# EAGLE design ESP32_SensorShield (EAGLE 8.7.1)
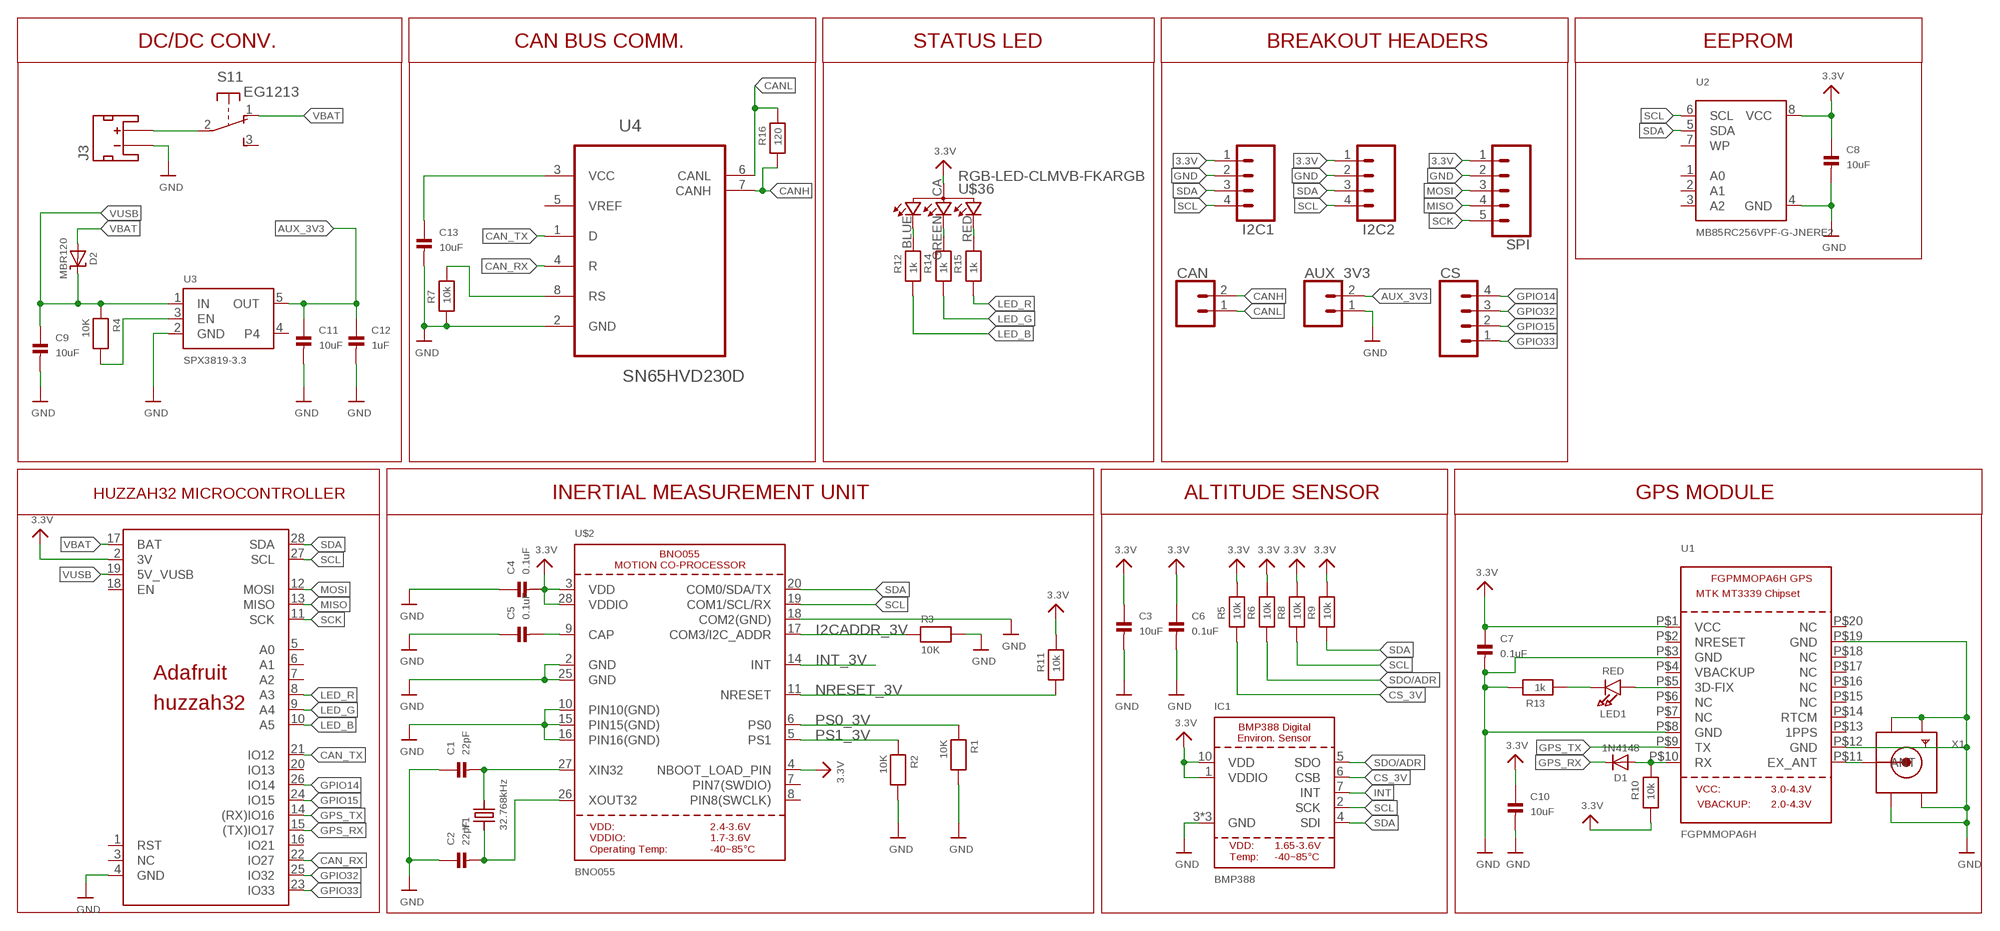
[diagram p0: schematic, sheet 1]

## Parts
AUX_3V3  CONN_02  [1X02]
C1  22pF  CAP_CERAMIC0603  [0603]
C2  22pF  CAP_CERAMIC0603  [0603]
C3  10uF  CAP_CERAMIC0805  [0805]
C4  0.1uF  CAP_CERAMIC0603  [0603]
C5  0.1uF  CAP_CERAMIC0603  [0603]
C6  0.1uF  CAP_CERAMIC0603  [0603]
C7  0.1uF  CAP_CERAMIC0603  [0603]
C8  10uF  CAP_CERAMIC0805  [0805]
C9  10uF  CAP_CERAMIC0805  [0805]
C10  10uF  CAP_CERAMIC0805  [0805]
C11  10uF  CAP_CERAMIC0805  [0805]
C12  1uF  CAP_CERAMIC0805  [0805]
C13  10uF  CAP_CERAMIC0805  [0805]
CAN  CONN_02  [1X02]
CS  CONN_04  [1X04]
D1  1N4148  DIODESOD-323  [SOD-323]
D2  MBR120  DIODE-SCHOTTKYSOD-123  [SOD-123]
I2C1  CONN_04  [1X04]
I2C2  CONN_04  [1X04]
IC1  BMP388  [BMP388]
J3  JST_2MM_MALE  [JST-2-SMD]
LED1  RED  LED0805  [CHIPLED_0805]
R1  10K  RESISTOR0603  [0603]
R2  10K  RESISTOR0603  [0603]
R3  10K  RESISTOR0603  [0603]
R4  10K  RESISTOR0603  [0603]
R5  10k  RESISTOR0603  [0603]
R6  10k  RESISTOR0603  [0603]
R7  10k  RESISTOR0603  [0603]
R8  10k  RESISTOR0603  [0603]
R9  10k  RESISTOR0603  [0603]
R10  10k  RESISTOR0603  [0603]
R11  10k  RESISTOR0603  [0603]
R12  1k  RESISTOR0603  [0603]
R13  1k  RESISTOR0603  [0603]
R14  1k  RESISTOR0603  [0603]
R15  1k  RESISTOR0603  [0603]
R16  120  RESISTOR0603  [0603]
S1  EG1213  [EG1213]
SPI  CONN_05  [1X05]
U1  FGPMMOPA6H  GPS_FGPMMOPA6H  [FGPMMOPA6H]
U2  MB85RC256VPF-G-JNERE2  FRAM_SOIC8_I2C  [SOIC8_208MIL]
U3  SPX3819-3.3  VREG_SOT23-5  [SOT23-5]
U4  SN65HVD230D  [SOIC127P600X175-8N]
U$1  ADAFRUIT-FEATHER-HUZZAH32-SHIELD  [ADAFRUIT-FEATHER-HUZZAH32-SHIELD]
U$2  BNO055  [BNO055]
U$36  RGB-LED-CLMVB-FKARGB  [PLCC4-2MM-RGB]
X1  SMACONNECTOR_EDGE  [SMA_EDGELAUNCH]
Y1  32.768kHz  CRYSTAL8.0X3.8  [CRYSTAL_8X3.8]

## Nets
3.3V: C3.1 C4.2 C6.1 C7.1 C8.1 C10.1 I2C1.1 I2C2.1 IC1.1(VDDIO) IC1.10(VDD) R5.2 R6.2 R8.2 R9.2 R10.1 R11.2 SPI.1 U1.P$1(VCC) U2.8(VCC) U$1.2(3V) U$2.3(VDD) U$2.4(NBOOT_LOAD_PIN) U$2.28(VDDIO) U$36.CA
AUX_3V3: AUX_3V3.2 C11.1 C12.1 U3.5(OUT)
CAN_RX: U4.4(R) U$1.22(IO27)
CAN_TX: U4.1(D) U$1.21(IO12)
CANH: CAN.2 R16.1 U4.7(CANH)
CANL: CAN.1 R16.2 U4.6(CANL)
CS_3V: IC1.6(CSB) R5.1
GND: AUX_3V3.1 C1.1 C2.1 C3.2 C4.1 C5.1 C6.2 C7.2 C8.2 C9.2 C10.2 C11.2 C12.2 C13.2 I2C1.2 I2C2.2 IC1.3(GND) IC1.8(GND) IC1.9(GND) J3.1(-) R1.2 R2.2 R3.2 R7.1 R13.2 SPI.2 U1.P$3(GND) U1.P$8(GND) U1.P$12(GND) U1.P$19(GND) U2.4(GND) U3.2(GND) U4.2(GND) U$1.4(GND) U$2.2(GND) U$2.10(PIN10(GND)) U$2.15(PIN15(GND)) U$2.16(PIN16(GND)) U$2.18(COM2(GND)) U$2.25(GND) X1.GND@1(GND4) X1.GND@2(GND3) X1.GND@3(GND2) X1.GND@4(GND1)
GPIO14: CS.4 U$1.26(IO14)
GPIO15: CS.2 U$1.24(IO15)
GPIO32: CS.3 U$1.25(IO32)
GPIO33: CS.1 U$1.23(IO33)
GPS_RX: D1.C U$1.15((TX)IO17)
GPS_TX: U1.P$9(TX) U$1.14((RX)IO16)
I2CADDR_3V: R3.1 U$2.17(COM3/I2C_ADDR)
INT: IC1.7(INT)
INT_3V: U$2.14(INT)
LED_B: R12.1 U$1.10(A5)
LED_G: R14.1 U$1.9(A4)
LED_R: R15.1 U$1.8(A3)
MISO: SPI.4 U$1.13(MISO)
MOSI: SPI.3 U$1.12(MOSI)
N$1: C1.2 U$2.27(XIN32) Y1.P$4
N$2: C2.2 U$2.26(XOUT32) Y1.P$1
N$3: U1.P$11(EX_ANT) X1.P(ANT)
N$4: C5.2 U$2.9(CAP)
N$5: D1.A R10.2 U1.P$10(RX)
N$6: J3.2(+) S1.2(1:P)
N$7: C13.1 U4.3(VCC)
N$8: LED1.C R13.1
N$9: LED1.A U1.P$5(3D-FIX)
N$10: R7.2 U4.8(RS)
N$11: R4.2 U3.3(EN)
N$12: R12.2 U$36.BLUE
N$13: R14.2 U$36.GREEN
N$14: R15.2 U$36.RED
NRESET_3V: R11.1 U$2.11(NRESET)
PS0_3V: R1.1 U$2.6(PS0)
PS1_3V: R2.1 U$2.5(PS1)
SCK: SPI.5 U$1.11(SCK)
SCL: I2C1.4 I2C2.4 IC1.2(SCK) R8.1 U2.6(SCL) U$1.27(SCL) U$2.19(COM1/SCL/RX)
SDA: I2C1.3 I2C2.3 IC1.4(SDI) R9.1 U2.5(SDA) U$1.28(SDA) U$2.20(COM0/SDA/TX)
SDO/ADR: IC1.5(SDO) R6.1
VBAT: D2.A S1.1(1:O) U$1.17(BAT)
VUSB: C9.1 D2.C R4.1 U3.1(IN) U$1.19(5V_VUSB)
Unconnected: J3.NC1(PAD1) J3.NC2(PAD2) S1.3(1:S) S1.MT1(MT) S1.MT2(MT) U1.P$2(NRESET) U1.P$4(VBACKUP) U1.P$6(NC) U1.P$7(NC) U1.P$13(1PPS) U1.P$14(RTCM) U1.P$15(NC) U1.P$16(NC) U1.P$17(NC) U1.P$18(NC) U1.P$20(NC) U2.1(A0) U2.2(A1) U2.3(A2) U2.7(WP) U3.4 U4.5(VREF) U$1.1(RST) U$1.3(NC) U$1.5(A0) U$1.6(A1) U$1.7(A2) U$1.16(IO21) U$1.18(EN) U$1.20(IO13) U$2.7(PIN7(SWDIO)) U$2.8(PIN8(SWCLK))

## Notes on the sheet
- DC/DC CONV. | CAN BUS COMM. | STATUS LED | BREAKOUT HEADERS | EEPROM
- HUZZAH32 MICROCONTROLLER | INERTIAL MEASUREMENT UNIT | ALTITUDE SENSOR | GPS MODULE

## Library data of the parts
AUX_3V3 CAN = SparkFun-Connectors:CONN_02: Multi connection point. Often used as Generic Header-pin footprint for 0.1 inch spaced/style header connections On any of the 0.1 inch spaced packages, you can populate with these: Break Away Headers - Straight <https://www.sparkfun.com/products/116> (PRT-00116) Break Away Male Headers - Right Angle <https://www.sparkfun.com/products/553> (PRT-00553) Female Headers <https://www.sparkfun.com/products/115> (PRT-00115) Break Away Headers - Machine Pin <https://www.sparkfun.com/products/117> (PRT-00117) Break Away Female Headers - Swiss Machine Pin <https://www.sparkfun.com/products/743> (PRT-00743) For SCREWTERMINALS and SPRING TERMINALS visit here: Screw Terimnals on SparkFun.com <https://www.sparkfun.com/search/results?term=Screw+Terminals> (5mm/3.5mm/2.54mm spacing) This device is also useful as a general connection point to wire up your design to another part of your project. Our various solder wires solder well into these plated through hole pads. Hook-Up Wire - Assortment (Stranded, 22 AWG) <https://www.sparkfun.com/products/11375> (PRT-11375) Hook-Up Wire - Assortment (Solid Core, 22 AWG) <https://www.sparkfun.com/products/11367> (PRT-11367) View the entire wire category on our website here <https://www.sparkfun.com/categories/141> Special notes: Molex polarized connector foot print use with: PRT-08233 with associated crimp pins and housings. 2.54_SCREWTERM for use with PRT-10571. 3.5mm Screw Terminal footprints for PRT-08084 5mm Screw Terminal footprints for use with PRT-08432
C1-C13 = microbuilder:CAP_CERAMIC: Ceramic Capacitors 0402 - 0402 Surface Mount Capacitors 16pF 50V 5% [Digikey: 445-4899-2-ND] 18pF 50V 5% [Digikey: 490-1281-2-ND] 22pF 50V 5% [Digikey: 490-1283-2-ND] 68pF 50V 5% [Digikey: 490-1289-2-ND] 0.1uF 10V 10% [Digikey: 490-1318-2-ND] 1.0uF 6.3V 10% [Digikey: 490-1320-2-ND] 0603 - 0603 Surface Mount Capacitors 16 pF 50V 5% [Digikey: 445-5051-2-ND] 22 pF 50V [Digikey: PCC220ACVTR-ND] 33 pF 50V 5% [Digikey: 490-1415-1-ND] 56pF 50V 5% [Digikey: 490-1421-1-ND] 220pF 50V 5% [Digikey: 445-1285-1-ND] 680 pF 50V 2200 pF 50V 5% C0G [Digikey: 445-1297-1-ND] 5600 pF 100V 5% X7R [Digikey: 478-3711-1-ND] 0.1 µF 25V 10% [Digikey: PCC2277TR-ND] 0.22 µF 16V 10% X7R [Digikey: 445-1318-1-ND] 1.0 µF 25V 10% [Digikey: 445-5146-2-ND] 0603 - RF Specific 3pF 250V +/-0.1pF RF [Digikey: 712-1347-1-ND] 18 pF 250V 5% [Digikey: 478-3505-1-ND or 712-1322-1-ND] 56 pF 250V 5% C0G RF [Digikey: 490-4867-1-ND] 68 pF 250V RF [Digikey: 490-4868-1-ND] 0805 - 0805 Surface Mount Capacitors 220 pF 250V 2% RF Ceramic Capacitor [Digikey: 712-1398-1-ND] 1000 pF 50V 2% NP0 Ceramic Capacitor [Digikey: 478-3760-1-ND] 0.1 µF 25V 10% Ceramic Capacitor [Digikey: PCC1828TR-ND] 1.0 µF 16V 10% Ceramic Capacitor[Digikey: 490-1691-2-ND] 10.0 µF 10V 10% Ceramic Capacitor[Digikey: 709-1228-1-ND] 10.0 uF 16V 10% Ceramic Capacitor [Digikey: 478-5165-2-ND] 47 uF 6.3V 20% Ceramic Capacitor [Digikey: 587-1779-1-ND or 399-5506-1-ND] 1206 - 1206 Surface Mount Capacitors 47uF 10V 20% Ceramic Capacitor [Digikey: 490-5528-1-ND or 399-5508-1-ND or 445-6010-1-ND]
CS I2C1 I2C2 = SparkFun-Connectors:CONN_04: Multi connection point. Often used as Generic Header-pin footprint for 0.1 inch spaced/style header connections On any of the 0.1 inch spaced packages, you can populate with these: Break Away Headers - Straight <https://www.sparkfun.com/products/116> (PRT-00116) Break Away Male Headers - Right Angle <https://www.sparkfun.com/products/553> (PRT-00553) Female Headers <https://www.sparkfun.com/products/115> (PRT-00115) Break Away Headers - Machine Pin <https://www.sparkfun.com/products/117> (PRT-00117) Break Away Female Headers - Swiss Machine Pin <https://www.sparkfun.com/products/743> (PRT-00743) For SCREWTERMINALS and SPRING TERMINALS visit here: Screw Terimnals on SparkFun.com <https://www.sparkfun.com/search/results?term=Screw+Terminals> (5mm/3.5mm/2.54mm spacing) This device is also useful as a general connection point to wire up your design to another part of your project. Our various solder wires solder well into these plated through hole pads. Hook-Up Wire - Assortment (Stranded, 22 AWG) <https://www.sparkfun.com/products/11375> (PRT-11375) Hook-Up Wire - Assortment (Solid Core, 22 AWG) <https://www.sparkfun.com/products/11367> (PRT-11367) View the entire wire category on our website here <https://www.sparkfun.com/categories/141> Special notes: Molex polarized connector foot print use with SKU : PRT-08231 with associated crimp pins and housings. 1MM SMD Version SKU: PRT-10208; PROD_ID: CONN-09696
D1 = microbuilder:DIODE: Diode SMA Model Volts Amps Type Vf Ir Digikey # Notes SSA34-E3 40V 3A Schottky 480mV @ 3A 200uA @ 40V SSA34-E3/61TGITR-ND CDBA120-G 20V 1A Schottky 500mV @ 1A 500uA @ 20V 641-1014-6-ND REEL MBRA210 10V 2A Schottky 350mV @ 2A 700uA @ 10V MBRA210LT3 SOD-123 Model Volts Amps Type Vf Ir Order # Notes BAT54T1G 30V 200mA Schottky 800mV @ 200mA 2uA @ 25V BAT54T1GOSTR-ND B0530W 30V 500mA Schottky 430mV @ 500mA 130uA @ 30V B0530W-FDICT-ND REEL MBR120 20V 1A Schottky 340mV @ 1A MBR120VLSFT1GOSCT-ND SOD-323 Model Volts Amps Type Vf Ir Order # Notes PMEG2005EJ 20V 500mA Schottky 355mV @ 500mA 568-4110-1-ND ZLLS410 10V 570mA Schottky 380mV @ 570mA ZLLS410CT-ND 1N4148WS 75V 150mA Silicon/Simple 1V 1N4148WSFSCT-ND REEL SOD-523 Model Volts Amps Type Vf Ir Order # Notes BAT54XV2 30V 200mA Schottky 0.8V @ 100mA BAT54XV2CT-ND TB751S 30V 30mA Schottky RB751S-40TE61CT-ND SOT23-R/W (R = Solder Paste/Reflow Ovens, W = Hand-Soldering) Model Volts Amps Type Vf Ir Order # Notes BAT54FILM 40V 300mA Schottky 497-7162-1-ND POWERDI-5 Model Volts Amps Type Vf Ir Order # Notes PDS560 60V 5A Schottky 670mV @ 5A 150uA @ 60V PDS560DICT-ND
D2 = microbuilder:DIODE-SCHOTTKY
IC1 = microbuilder:BMP388
J3 = SparkFun-Connectors:JST_2MM_MALE: JST 2MM MALE RA CONNECTOR Two pin, compact surface mount connector. Commonly used as a battery input connection point. We really like the solid locking feeling and high current rating on these small connectors. We use these all the time as battery connectors. Mates to single-cell LiPo batteries. Here is the connector we sell at SparkFun: JST Right Angle Connector - White <https://www.sparkfun.com/products/8612> (PRT-08612) Datasheet <http://www.sparkfun.com/datasheets/Prototyping/Connectors/JST-Horizontal.pdf> It was used on these SparkFun products: SparkFun MOSFET Power Controller <https://www.sparkfun.com/products/11214> (PRT-11214) SparkFun Battery Babysitter - LiPo Battery Manager <https://www.sparkfun.com/products/13777> (PRT-13777) And many, many others that required a lipo battery connection.; PROD_ID: CONN-11443; SF_ID: PRT-08612
LED1 = microbuilder:LED: LED 0603 - 0603 Surface Mount Package 2mA: Green LED - Low Power (3.9mcd, 2ma, 1.7Vf) - Digikey: 475-2709-2-ND Orange LED - Low Power (9.8mcd, 2ma, 1.8Vf) - Digikey: 475-1194-2-ND Red LED - Low Power (5mcd, 2ma, 1.8Vf) - Digikey: 475-1195-2-ND Yellow LED - Low Power (7mcd, 2ma, 1.8Vf) - Digikey: 475-1196-2-ND 5mA: Blue LED - Low Power (17mcd, 5ma, 2.9Vf) - Digikey: LNJ937W8CRACT-ND 0805 - 0805 Surface Mount Package 2mA: Red LED (8.8mcd, 2mA, 1.8Vf, Clear) - Low Power [Digikey: 475-2510-1-ND] Green LED (5mcd, 2mA, 1.8Vf, Clear) - Low Power [Digikey: 475-2730-1-ND] Yellow LED (11.3mcd, 2mA, 1.8Vf, Clear) - Low Power [Digikey: 475-2555-1-ND] 20mA: Red LED (104mcd, 20mA, Diffused) - LS R976 [Digikey: 475-1278-6-ND] Red LED (12mcd, 20mA, 2.0Vf, Clear) - APT2012EC [Digikey: 754-1128-1-ND] Green LED (15mcd, 20mA, 2.2Vf, Clear) - APT2012GC [Digikey: 754-1131-1-ND] Orange LED (160mcd, 20mA, 2.1Vf, Clear) - APT2012SECK [Digikey: 754-1130-1-ND] 1206 - 1206 Surface Mount Package Green LED (26mcd, 20mA, Diffused) - LG N971 [Digikey: 475-1407-6-ND] Red LED (15mcd, 20mA, Diffused) - LH N974 [Digikey: 475-1416-6-ND] Cree - Cree High-Power Surface Mount LEDs XPEBWT-L1-0000-00D50 - White 111lm 350mA 2.9Vf 6200K 110° XTEAWT-00-0000-00000LEE3 - White 114lm 350mA 2.85Vf 5000K 115° Everlight - Everlight 45-21 Series Surface Mount LEDs 45-21/QK2C-B2832AC2CB2/2T - Warm White 2000mcd 20mA 3.25Vf 3050K 120° 45-21/LK2C-B38452C4CB2/2T - Nuetral White 2000mcd 20mA 3.25Vf 4150K 120° 45-21/LK2C-B50634C6CB2/2T - Cold White 2200mcd 20mA 3.25Vf 5650K 120° PLCC2 Reverse Mount LS T77K-J1L2-1-0-2-R18-Z - Red 11.25mcd 2mA 1.8Vf 630nm 120° LO T77K-L1M2-24-Z - Orange 19.6mcd 2mA 1.8Vf 606nm 120° LY T77K-K2M1-26-Z - Yellow 15.7mcd 2mA 1.8Vf 587nm 120°
R1-R16 = microbuilder:RESISTOR: Resistors 0402 - 0402 Surface Mount Package 22 Ohm 1% 1/16W [Digikey: 311-22.0LRTR-ND] 33 Ohm 5% 1/16W 1.0K 5% 1/16W 1.5K 5% 1/16W 2.0K 1% 1/16W 10.0K 1% 1/16W [Digikey: 311-10.0KLRTR-ND] 10.0K 5% 1/16W [Digikey: RMCF0402JT10K0TR-ND] 12.1K 1% 1/16W [Digikey: 311-22.0LRTR-ND] 100.0K 5% 1/16W 0603 - 0603 Surface Mount Package 0 Ohm 1/10 Watt 1% Resistor 15 Ohm 1/10 Watt 1% Resistor 33 Ohm 1/10 Watt 1% Resistor 49.9 Ohm 1/10 Watt 1% Resistor 100 Ohm 1/10 Watt 1% Resistor 150 Ohm 1/10 Watt 1% Resistor 240 Ohm 1/10 Watt 1% Resistor 390 Ohm 1/10 Watt 1% Resistor 560 Ohm 1/10 Watt 1% Resistor 680 Ohm 1/10 Watt 1% Resistor 750 Ohm 1/10 Watt 1% Resistor 1.0K Ohm 1/10 Watt 1% Resistor 1.5K Ohm 1/10 Watt 1% Resistor 2.0K Ohm 1/10 Watt 1% Resistor 2.2K Ohm 1/10 Watt 1% Resistor 3.3K Ohm 1/10 Watt 1% Resistor 4.7K Ohm 1/10 Watt 1% Resistor 10.0K Ohm 1/10 Watt 1% Resistor 12.0K Ohm 1/10 Watt 1% Resistor 12.1K Ohm 1/10 Watt 1% Resistor 20.0K Ohm 1/10 Watt 1% Resistor 33.0K Ohm 1/10 Watt 1% Resistor 100.0K Ohm 1/10 Watt 1% Resistor 0805 - 0805 Surface Mount Package 0 Ohm 1/8 Watt 1% Resistor 33 Ohm 1/8 Watt 1% Resistor 100 Ohm 1/8 Watt 1% Resistor 150 Ohm 1/8 Watt 1% Resistor 200 Ohm 1/8 Watt 1% Resistor 240 Ohm 1/8 Watt 1% Resistor 330 Ohm 1/8 Watt 1% Resistor 390 Ohm 1/8 Watt 1% Resistor 470 Ohm 1/8 Watt 1% Resistor 1.0K Ohm 1/8 Watt 1% Resistor 1.5K Ohm 1/8 Watt 1% Resistor 2.0K Ohm 1/8 Watt 1% Resistor 4.7K Ohm 1/8 Watt 1% Resistor 5.1K Ohm 1/8 Watt 1% Resistor 5.6K Ohm 1/8 Watt 1% Resistor 10.0K Ohm 1/8 Watt 1% Resistor 22.0K Ohm 1/8 Watt 1% Resistor 33.0K Ohm 1/8 Watt 1% Resistor 100K Ohm 1/8 Watt 1% Resistor 1206 - 1206 Surface Mount Package 2012 - 2010 Surface Mount Package 0.11 Ohm 1/2 Watt 1% Resistor - Digikey: RHM.11UCT-ND
S1 = adafruit:EG1213: E-Switch right-angle slide SPDT Part #EG1213 http://www.ladyada.net/library/eagle
SPI = SparkFun-Connectors:CONN_05: Multi connection point. Often used as Generic Header-pin footprint for 0.1 inch spaced/style header connections On any of the 0.1 inch spaced packages, you can populate with these: Break Away Headers - Straight <https://www.sparkfun.com/products/116> (PRT-00116) Break Away Male Headers - Right Angle <https://www.sparkfun.com/products/553> (PRT-00553) Female Headers <https://www.sparkfun.com/products/115> (PRT-00115) Break Away Headers - Machine Pin <https://www.sparkfun.com/products/117> (PRT-00117) Break Away Female Headers - Swiss Machine Pin <https://www.sparkfun.com/products/743> (PRT-00743) For SCREWTERMINALS and SPRING TERMINALS visit here: Screw Terimnals on SparkFun.com <https://www.sparkfun.com/search/results?term=Screw+Terminals> (5mm/3.5mm/2.54mm spacing) This device is also useful as a general connection point to wire up your design to another part of your project. Our various solder wires solder well into these plated through hole pads. Hook-Up Wire - Assortment (Stranded, 22 AWG) <https://www.sparkfun.com/products/11375> (PRT-11375) Hook-Up Wire - Assortment (Solid Core, 22 AWG) <https://www.sparkfun.com/products/11367> (PRT-11367) View the entire wire category on our website here <https://www.sparkfun.com/categories/141> Special notes: Molex polarized connector foot print use with SKU : PRT-08231 with associated crimp pins and housings. 1MM SMD Version SKU: PRT-10208
U1 = microbuilder:GPS_FGPMMOPA6H: GPS Module - MTK MT3339 Chipset, -165dBm sensitivity, 22 channels, 10Hz, auto-select external antenna options
U2 = microbuilder:FRAM_SOIC8_I2C: I2C FRAM - SOIC8 Package 256KBit (32Kx8) - MB85RC256VPF-G-JNERE2 - SOIC-8 200 Mil, 2.7-5.5V, -40°C-85°C
U3 = microbuilder:VREG_SOT23-5: SOT23-5 Fixed Voltage Regulators Part Current Out V Out V In V Dropout θJA (°C/W) TJ (°C) Digikey Part No. ADP121 150mA 3.3V 3.4-5.5V 0.09V @ 150mA -- -- ADP121-AUJZ33R7CT-ND ADP121 150mA 3.0V 3.1-5.5V 0.09V @ 150mA -- -- ADP121-AUJZ30R7CT-ND ADP122 300mA 3.3V 3.4-5.5V 0.085V @ 300mA -- -- ADP122AUJZ-3.3-R7CT-ND ADP1712 300mA 3.3V 3.5-5.5V 0.17V @ 300mA -- -- ADP1712AUJZ-3.3-R7TR-ND AP7311 (Low Cost) 150mA 3.3V 3.5-6V 0.15V @ 150mA -- -- AP7311-33WG-7DICT-ND LD39015M18R 150mA 1.8V 1.9V-5.5V 0.08V @ 100mA -- -- 497-6977-1-ND LP2985A-33DBVR 150mA 3.3V 3.3-16V 0.28V @ 150mA 206 150 296-18479-1-ND MCP1824T-3302E/OT 300mA 3.3V 3.5V-6V 0.2V @ 300mA -- -- MCP1824T-3302E/OTCT-ND MIC5205-2.5YM5 TR 150mA 2.5V 2.7-16V 0.165V @ 150mA -- -- 576-1257-2-ND MIC5205-3.0YM5 TR 150mA 3.0V 3.2V-16V 0.165V @ 150mA -- -- 576-1258-2-ND MIC5205-3.3YM5 TR 150mA 3.3V 3.5V-16V 0.165V @ 150mA -- -- 576-1259-2-ND TPS780330220 150mA 3.3V+2.2V 3.6-5.5V 250mV Max -- -- 296-23332-1-ND TDA3663/N1,135 100mA 3.3V 3.5-45V 0.18V @ 50mA -- -- 568-5343-1-ND Max operating temp can be calculated using θJA, TJ (max junction temperature), and power in watts. Set the "Maximum Ambient Temperature" until it reaches TJ ("Max Junction Temperature"), which is the absolute limit for safe use of the regulator: Heat Sink Temperature Calculator <http://www.daycounter.com/Calculators/Heat-Sink-Temperature-Calculator.phtml> For example, With 12V source into a 3.3V LP2985 and a 30mA load, we are dissipating (12V-3.3V) * 0.03A = 0.261W. With a θJA of 206 °C/W, a TJ of 150°C, and 261mW we can safely use the chip without a heat sink up to 75°C (=147.1°C Junction Temperature).
U4 = SN65HVD230D:SN65HVD230D: 3.3-V CAN TRANSCEIVERS; AVAILABILITY: Unavailable; DESCRIPTION: 1/1 Transceiver Half CANbus 8-SOIC; MF: Texas Instruments; MP: SN65HVD230D; PACKAGE: SOIC-8 Texas Instruments; PRICE: None
U$1 = Shawn'sCustomComponents:ADAFRUIT-FEATHER-HUZZAH32-SHIELD
U$2 = microbuilder:BNO055: BNO055 - Motion Co-Processor
U$36 = Particle:RGB-LED-CLMVB-FKA: CREE CLMVB-FKA RGB LED 2mm x 2mm
X1 = adafruit:SMACONNECTOR: SMA Connector 90° DIP SMA Connector, 50 Ohm (4UConnector: 07259)
Y1 = microbuilder:CRYSTAL: Crystals HC49UP - Surface Mount Crystal 4.0MHz 18pF +/-30ppm Surface Mount Crystal [Digikey: 535-9857-1-ND] 12.0 MHz Surface Mount Crystal [Digikey: 535-9869-6-ND] 25.0 MHz Surface Mount Crystal [Digikey: 535-9078-1-ND] 2.5 x 2.0mm - MEMs SMT Crystal 16.0 MHz 10pF 20ppm 2.5 x 2.0mm Crystal [Digikey -40-85°C: 535-10923-1-ND] 3.2 x 2.5mm - MEMs SMT Crystal 12.0 MHz 8pF 15ppm 3.2 x 2.5mm Crystal [Digikey: -10-70°C: 644-1047-1-ND -40-125°C: 644-1128-1-ND] 40~85°C cheaper: 644-1173-6-ND 16.0 MHz 8pF 15ppm 3.2 x 2.5mm Crystal [Digikey: -10-70°C: 644-1049-1-ND -40-125°C: 644-1129-2-ND]-40~85°C cheaper: 644-1175-6-ND 16.0 MHz 10pF 10ppm 3.2 x 2.5mm Crystal [Digikey: 644-1100-1-ND] 27.12 MHz 18pF 30ppm 3.2 x 2.5mm Crystal [Digikey: 887-1424-1-ND] 27.12MHz 10pF 10ppm 3.2 x 2.5mm Crystal [Digikey: 887-1329-1-ND] 4.9 x 1.8mm - MEMs SMT Crystal 32.768 KHz 12.5pF 20ppm 4.9 x 1.8mm Crystal [Digikey: SE2415CT-ND] 8.0 x 3.8mm - Surface Mount Crystal 32.768kHz 12.5pF 20ppm -40°C-85°C [Digikey: 535-9166-2-ND] Cylinder 32.768KHz Cylinder Crystal (2x6mm body) [Ex. Digikey: 300-8341-2-ND]

## Board
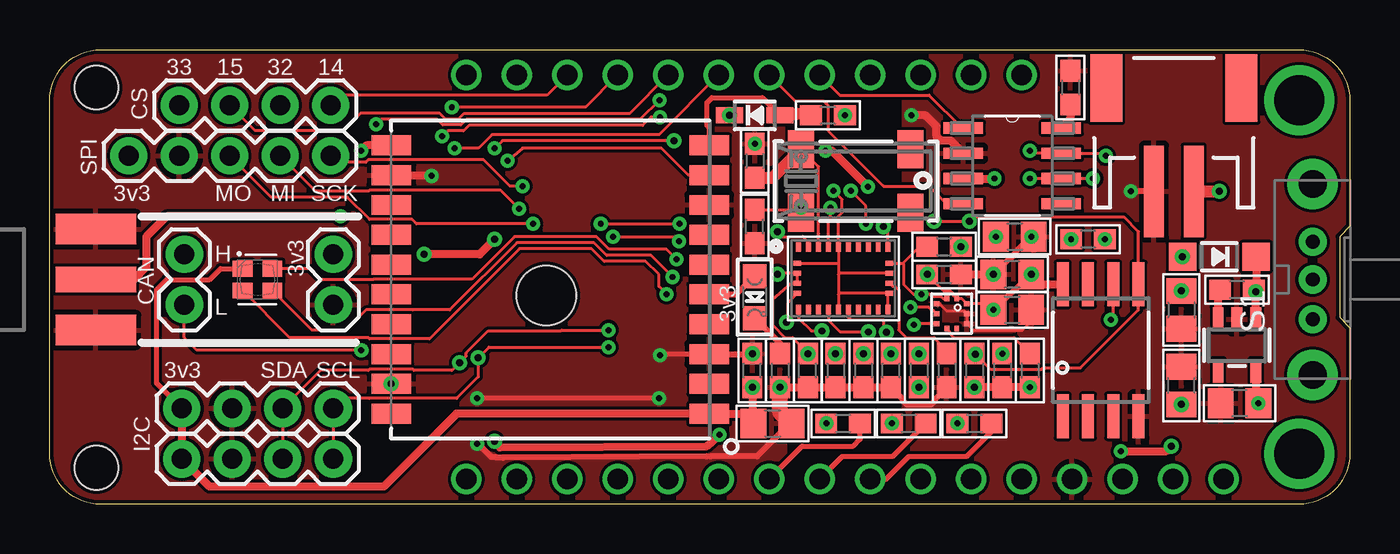
[diagram p1: board, top side]
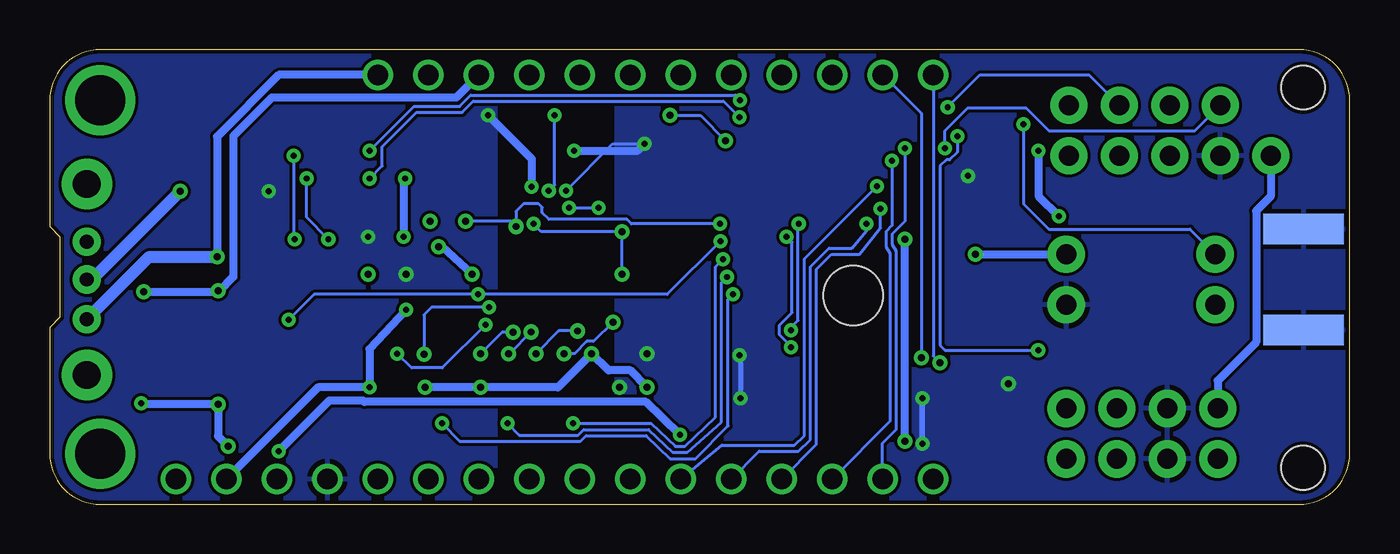
[diagram p2: board, bottom side, seen from below]

Size 65.41 x 22.86 mm. Coordinates in mm from the lower left corner, seen from the top.
Copper layers (1*16): Top 0.035mm / dielectric 1.5mm / Bottom 0.035mm
Design rules "default *": minimum track width 6mil, minimum drill 0.35mm, track to track 6mil, track to pad 6mil, pad to pad 6mil, via to via 6mil, smd to smd 6mil, copper to edge 8mil, drill to drill 6mil, minimum pad ring 10mil, minimum via ring 8mil, stop-mask expansion 4mil, vias tented up to drill 0mil, thermal gap 10mil

### Footprints (pad centres in the part's own frame; a part is rotated, then mirrored left to right if it is on the bottom)
1X02 = drill 1.016 pad 1.88: 1 0,0; 2 2.54,0
0603 = smd 1.1 x 1: 1 -0.85,0; 2 0.85,0
0805 = smd 1.3 x 1.5: 1 -0.95,0; 2 0.95,0
1X04 = drill 1.016 pad 1.88: 1 0,0; 2 2.54,0; 3 5.08,0; 4 7.62,0
SOD-323 = smd 1.35 x 0.8: A 1.27,0; C -1.27,0
SOD-123 = smd 1.4 x 1.4: A 1.85,0; C -1.85,0
BMP388 = smd 0.25 x 0.275: 1 0.25,0.75; 2 -0.25,0.75; 6 -0.25,-0.75; 7 0.25,-0.75 | smd 0.275 x 0.25: 3 -0.762,0.5; 4 -0.762,0; 5 -0.762,-0.5; 8 0.762,-0.5; 9 0.762,0; 10 0.762,0.5
JST-2-SMD = smd 1 x 4.6: 1 -1,-3.7; 2 1,-3.7 | smd 1.6 x 3.4: NC1 -3.4,1.5; NC2 3.4,1.5
CHIPLED_0805 = smd 1.2 x 1.2: A 0,-1.05; C 0,1.05
EG1213 = drill 0.7 pad 1.422: 1 -2,0; 2 0,0; 3 1.9,0 | drill 1.4 pad 2.54: MT1 -4.8,0; MT2 4.8,0
1X05 = drill 1.016 pad 1.88: 1 0,0; 2 2.54,0; 3 5.08,0; 4 7.62,0; 5 10.16,0
FGPMMOPA6H = smd 2 x 1: P$1 -8,6.75; P$2 -8,5.25; P$3 -8,3.75; P$4 -8,2.25; P$5 -8,0.75; P$6 -8,-0.75; P$7 -8,-2.25; P$8 -8,-3.75; P$9 -8,-5.25; P$10 -8,-6.75; P$11 8,-6.75; P$12 8,-5.25; P$13 8,-3.75; P$14 8,-2.25; P$15 8,-0.75; P$16 8,0.75; P$17 8,2.25; P$18 8,3.75; P$19 8,5.25; P$20 8,6.75 | hole 3: 0.2,0.8
SOIC8_208MIL = smd 0.6 x 2.2: 1 -1.905,-3.315; 2 -0.635,-3.315; 3 0.635,-3.315; 4 1.905,-3.315; 5 1.905,3.315; 6 0.635,3.315; 7 -0.635,3.315; 8 -1.905,3.315
SOT23-5 = smd 0.55 x 1.2: 1 -0.95,-1.3; 2 0,-1.3; 3 0.95,-1.3; 4 0.95,1.3; 5 -0.95,1.3
SOIC127P600X175-8N = smd 1.981 x 0.559: 1 -2.464,1.905; 2 -2.464,0.635; 3 -2.464,-0.635; 4 -2.464,-1.905; 5 2.464,-1.905; 6 2.464,-0.635; 7 2.464,0.635; 8 2.464,1.905
ADAFRUIT-FEATHER-HUZZAH32-SHIELD = drill 1.016: 1 6.16,1.397; 2 8.7,1.397; 3 11.239,1.397; 4 13.78,1.397; 5 16.32,1.397; 6 18.86,1.397; 7 21.399,1.397; 8 23.939,1.397; 9 26.48,1.397; 10 29.02,1.397; 11 31.559,1.397; 12 34.099,1.397; 13 36.639,1.397; 14 39.179,1.397; 15 41.719,1.397; 16 44.26,1.397; 17 16.32,21.717; 18 18.86,21.717; 19 21.399,21.717; 20 23.939,21.717; 21 26.48,21.717; 22 29.02,21.717; 23 31.559,21.717; 24 34.099,21.717; 25 36.639,21.717; 26 39.179,21.717; 27 41.719,21.717; 28 44.26,21.717 | drill 2.5: 29 2.349,20.447; 30 2.349,2.667 | hole 2.2: 62.865,1.968; 62.865,21.082
BNO055 = smd 0.25 x 0.475: 1 -2.25,1.562; 6 -2.25,-1.562; 7 -1.75,-1.562; 8 -1.25,-1.562; 9 -0.75,-1.562; 10 -0.25,-1.562; 11 0.25,-1.562; 12 0.75,-1.562; 13 1.25,-1.562; 14 1.75,-1.562; 15 2.25,-1.562; 20 2.25,1.562; 21 1.75,1.562; 22 1.25,1.562; 23 0.75,1.562; 24 0.25,1.562; 25 -0.25,1.562; 26 -0.75,1.562; 27 -1.25,1.562; 28 -1.75,1.562 | smd 0.375 x 0.25: 2 -2.312,0.75; 3 -2.312,0.25; 4 -2.312,-0.25; 5 -2.312,-0.75; 16 2.312,-0.75; 17 2.312,-0.25; 18 2.312,0.25; 19 2.312,0.75
PLCC4-2MM-RGB = smd 1 x 0.8: BLUE -0.75,-0.55; CA 0.75,-0.55; GREEN -0.75,0.55; RED 0.75,0.55
SMA_EDGELAUNCH = smd 4.064 x 1.524: GND@1 2.032,-2.54; GND@2 2.032,2.54 | smd 4.064 x 1.524 bottom: GND@3 2.032,2.54; GND@4 2.032,-2.54 | smd 4.064 x 1.27: P 2.032,0
CRYSTAL_8X3.8 = smd 1.3 x 1.9: P$1 -2.75,-1.6; P$2 2.75,-1.6; P$3 2.75,1.6; P$4 -2.75,1.6

### Placement (x,y rotation side)
AUX_3V3  14.26,10.03 90 top
C1  35.47,17.27 270 top
C2  35.47,13.97 90 top
C3  48.43,9.78 0 top
C4  38.14,6.73 90 top
C5  42.33,6.73 90 top
C6  45,11.56 0 top
C7  35.34,6.73 90 top
C8  48.43,11.56 180 top
C9  56.93,9.78 270 top
C10  36.36,4.06 0 top
C11  59.86,5.08 180 top
C12  56.93,5.97 90 top
C13  48.55,13.46 0 top
CAN  6.77,10.03 90 top
CS  6.52,20.07 0 top
D1  35.47,19.56 0 top
D2  58.84,12.45 180 top
I2C1  6.64,2.29 0 top
I2C2  6.64,4.83 0 top
IC1  45.38,9.59 0 top
J3  56.55,19.43 0 top
LED1  35.47,10.41 180 top
R1  40.93,6.73 270 top
R2  39.54,6.73 270 top
R3  45.12,6.73 270 top
R4  59.73,10.79 180 top
R5  49.31,6.73 270 top
R6  47.92,6.73 270 top
R7  51.35,20.95 270 top
R8  45,12.95 0 top
R9  46.52,6.73 270 top
R10  39.15,19.56 180 top
R11  43.73,6.73 270 top
R12  39.92,4.06 180 top
R13  36.74,6.73 270 top
R14  43.22,4.06 180 top
R15  46.52,4.06 180 top
R16  52.24,13.34 180 top
S1  63.54,11.3 90 top
SPI  3.98,17.53 0 top
U1  25.18,11.3 180 top
U2  52.87,7.75 0 top
U3  59.73,8 180 top
U4  48.43,17.02 0 top
U$1  65.21,-0.13 0 bottom
U$2  39.93,11.37 0 top
U$36  10.45,11.3 180 top
X1  0.29,11.3 0 top
Y1  40.55,16.26 0 top

### Tracks (layer width: path | path; a pad name or v marks a point on that pad's centre or on a via)
3.3V  (via drill 0.3, 0.35)
  Top 0.152: v36.61,11.56 36.67,11.62 U$2.3 U$2.4 37.32,11.12 36.36,10.29 36.36,9.02 37,8.38 37.38,8.38 38.14,7.62 C4.2 | v36.61,13.72 36.87,13.46 37.88,13.46 38.18,13.17 U$2.28 | C3.1 47.04,10.09 IC1.10 45.89,10.34 IC1.1 45.48,10.48 45.48,10.57 45.3,10.75 44.96,10.75 C6.1 | v41.06,14.1 41.06,15 v40.3,15.76
  Top 0.254: I2C2.1 5.37,6.1 5.37,10.79 5.88,11.3 8.04,11.3 8.59,11.85 U$36.CA
  Top 0.305: C3.1 C8.1
  Top 0.406: R5.2 R6.2 R9.2 | C8.1 49.87,11.06 U2.8 | 35.25,4.22 34.92,4.55 U1.P$1 20.47,4.55 16.8,0.89 8.04,0.89 I2C1.1 I2C2.1 | 35.25,4.22 C10.1 | C7.1 35.34,4.32 35.25,4.22
  Bottom 0.152: v36.61,11.56 v36.61,13.72 40.68,13.72 v41.06,14.1 | v40.3,15.76 40,16.06 R10.1
  Bottom 0.406: 46.46,5.94 R9.2 R11.2 39.84,5.88 C4.2 37.29,6.73 36.19,6.73 C7.1 | C6.1 45.67,12.95 R8.2 | C3.1 49.31,7.81 R5.2 51.9,5.88 U$1.2 | SPI.1 3.98,15.49 4.71,14.75 4.71,8.15 6.64,6.22 I2C2.1
  other vias: 43.73,5.88 46.52,5.88 49.38,11.56 44.15,11.56 45.85,12.95 38.14,7.58 35.34,5.88 47.48,9.78 49.31,5.88 40,19.56
AUX_3V3  (via drill 0.3, 0.35)
  Top 0.406: U3.5 60.68,5.33 C11.1 | v22.39,3.17 22.64,2.86 33.06,2.92 v33.69,3.49 | v22.39,13.34 21.63,12.57 v18.83,12.57 | v53.89,2.67 56.17,2.67 v56.43,2.92
  Bottom 0.406: v56.43,2.92 56.93,3.43 C12.1 60.74,5.02 C11.1 | v22.39,3.17 v22.39,13.34 | v18.83,12.57 AUX_3V3.2 | v33.69,3.49 35.41,5.15 49.58,5.15 49.64,5.21 51.35,5.21 v53.89,2.67
  other vias: 56.93,5.02 60.81,5.08
CAN_RX
  Top 0.152: U$1.22 37.47,20.31 37.51,20.31 37.54,20.29 38.95,20.29 39.08,20.15 39.08,20.14 39.15,20.07 39.15,18.8 41.95,16 44.23,16 45.12,15.11 U4.4
CAN_TX
  Top 0.152: U$1.21 39.75,20.57 44.23,20.57 45.89,18.92 U4.1
CANH  (via drill 0.3)
  Top 0.152: v49.31,17.78 49.44,17.65 U4.7 53,17.65 v53.12,17.53 | v30.67,20.32 29.71,19.36 20.97,19.36 20.69,19.08 19.77,19.08 19.49,19.36 16.68,19.36 v16.42,19.1
  Bottom 0.152: v49.31,17.78 47.08,20.02 44.78,20.02 44.22,20.57 30.92,20.57 v30.67,20.32 | v16.42,19.1 16.42,15.11 15.15,13.84 8.04,13.84 CAN.2 | v53.12,17.53 53.12,13.37 R16.1
  other vias: 53.09,13.34
CANL  (via drill 0.3)
  Top 0.152: v49.31,16.38 U4.6 v52.49,16.38 | v30.71,19.46 30.24,19.46 29.83,19.05 21.1,19.05 20.82,18.78 20.03,18.78 v19.75,18.5 | v15.68,7.75 7.4,7.75 6.77,8.38 CAN.1
  Bottom 0.152: v49.31,16.38 48.68,17.02 48.68,17.98 46.95,19.71 44.65,19.71 44.09,20.27 31.51,20.27 v30.71,19.46 | v19.75,18.5 19.75,17.7 20.13,17.32 20.31,17.32 20.61,17.02 20.61,8 20.36,7.75 v15.68,7.75 | R16.2 52.49,14.44 v52.49,16.38
  other vias: 51.39,13.34
CS_3V
  Top 0.152: IC1.6 45.27,8.69 45.27,8.61 45.5,8.38 48.51,8.38 R5.1
GND  (via drill 0.3, 0.35)
  Top 0.152: 39.68,12.06 U$2.25 39.68,14.48 39.86,14.66 39.86,15.34 v39.44,15.76 | 39.68,12.06 39.68,11.56 | 39.68,11.56 39.68,10.54 | 39.68,10.54 U$2.10 | U$2.2 39.63,12.12 39.68,12.06 | U$2.18 39.74,11.62 39.68,11.56 | 39.68,10.54 39.75,10.62 U$2.16 42.18,10.55 U$2.15 | IC1.3 44.77,10.09 45.12,9.73 45.99,9.73 IC1.9 IC1.8 46.47,8.76 48.93,8.76 49.38,9.21 C3.2
  Top 0.254: U1.P$3 30.76,7.55 v30.7,7.49 | v30.65,5.33 v21.5,5.33
  Top 0.305: C8.2 48.33,12.41 48.38,12.41 48.56,12.59 48.56,12.64 v49.38,13.46 C13.2 | C10.2 37.24,4.06 35.59,2.41 33.25,2.41 33.24,2.4 33.05,2.41 22.82,2.35 22.8,2.33 22.62,2.35 22.44,2.35 22.41,2.37 22.23,2.37 21.55,3.05 v21.5,3.05 | U1.P$3 35.32,7.55 C7.2 | C5.1 42.92,5.29 42.92,5.21 43.1,5.03 44.35,5.03 44.53,5.21 44.53,5.29 R3.2 | J3.1 54.41,15.73 v54.39,15.75
  Top 0.406: C6.2 C8.2 | R13.2 C4.1 R2.2 R1.2 C5.1 | v43.35,19.56 44.06,19.56 44.62,19 44.62,18.5 44.82,18.29 45.33,18.29 U4.2 | v41.16,15.97 39.35,17.78 v39.03,17.78 | U1.P$12 19.17,16.55 v19.22,16.51
  Top 0.813: C10.2 36.74,4.63 R13.2
  Bottom 0.152: v39.44,15.76 37.08,18.12 C1.1
  Bottom 0.254: v30.7,7.49 30.65,7.44 v30.65,5.33
  Bottom 0.305: v21.5,3.05 v21.5,5.33
  Bottom 0.406: v43.35,19.56 41.16,17.37 v41.16,15.97 | v39.03,17.78 35.81,17.78 C1.1
  other vias: 47.48,11.56 35.34,7.58 36.74,5.88 17.18,6.05 35.47,18.12
  pour Top: -0.6,23.37 -0.6,-0.25 35.6,-0.51 37,-0.51 37,23.24 14.39,23.24
  pour Top: 65.57,23.37 42.96,23.37 42.96,-0.64 65.57,-0.64
  pour Bottom: -1.23,23.88 -1.23,-0.38 34.58,-0.76 36.87,-0.76 36.87,23.5
  pour Bottom: 42.96,-1.02 42.96,23.24 65.82,23.24 65.82,-1.02
GPIO14
  Top 0.152: U$1.26 25.02,20.57 14.64,20.57 CS.4
GPIO15
  Top 0.152: CS.2 10.33,18.8 14.77,18.8 15.66,19.68 19.6,19.68 19.9,19.39 20.57,19.39 20.84,19.66 29.19,19.66 U$1.24
GPIO32  (via drill 0.3)
  Top 0.152: v20.23,19.97 26.95,19.97 U$1.25
  Bottom 0.152: v20.23,19.97 18.61,21.59 13.12,21.59 CS.3
GPIO33  (via drill 0.3)
  Top 0.152: v20.37,17.91 21.57,17.91 22.25,18.59 30.66,18.59 U$1.23
  Bottom 0.152: v20.37,17.91 20.37,18.78 19.22,19.94 16.29,19.94 15.15,18.8 7.79,18.8 CS.1
GPS_RX  (via drill 0.3, 0.35)
  Top 0.152: v31.41,18.29 22.77,18.29 v22.39,17.91
  Bottom 0.152: D1.C 32.68,19.56 v31.41,18.29 | v22.39,17.91 22.39,14.22 23.03,13.59 23.03,13.08 22.82,12.75 22.82,3.76 23.53,3.05 23.53,1.31 U$1.15
  other vias: 34.2,19.56
GPS_TX  (via drill 0.3)
  Top 0.152: U1.P$9 32.13,16.55 30.77,17.91 23.79,17.91 v23.03,17.27
  Bottom 0.152: v23.03,17.27 23.03,14.02 23.33,13.71 23.33,12.96 23.13,12.62 23.13,4.18 U$1.14
I2CADDR_3V
  Top 0.152: U$2.17 42.39,10.97 42.52,10.97 42.7,10.79 42.71,10.79 42.71,8.76 43.09,8.38 44.49,8.38 45.12,7.75 R3.1
LED_B
  Top 0.254: U$1.10 37.85,2.92 40.42,2.92 40.77,3.26 R12.1
LED_G
  Top 0.254: U$1.9 39.88,2.41 42.42,2.41 R14.1
LED_R
  Top 0.254: U$1.8 42.08,1.27 43.22,2.41 46.14,2.41 47.37,3.64 R15.1
MISO  (via drill 0.3)
  Top 0.152: v23.61,14.86 22.68,15.78 16.09,15.78 16.06,15.75 13.37,15.75 SPI.4
  Bottom 0.152: U$1.13 26.84,3.01 26.84,11.81 26.07,12.57 24.68,12.57 23.61,13.9 v23.61,14.86
MOSI  (via drill 0.3)
  Top 0.152: v24.32,14.1 18.45,14.1 18.41,14.14 18.41,14.15 18.24,14.32 16.09,14.32 14.97,15.44 11.14,15.44 SPI.3
  Bottom 0.152: v24.32,14.1 24.32,13.75 25.06,12.88 26.2,12.88 27.14,11.94 27.14,3.25 27.72,2.67 29.72,2.67 U$1.12
N$1
  Top 0.152: U$2.27 38.68,13.61 38.68,16.98 Y1.P$4
  Top 0.61: C1.2 36.37,16.42 Y1.P$4
N$2  (via drill 0.3)
  Top 0.152: U$2.26 39.18,14.25 39.28,14.48 v39.28,14.9 | C2.2 37.72,14.82 v37.8,14.9 Y1.P$1
  Bottom 0.152: v39.28,14.9 v37.8,14.9
N$3  (via drill 0.3)
  Top 0.406: U1.P$11 15.93,18.05 v15.66,17.78 | v14.64,14.48 5.88,14.48 4.86,13.46 4.86,11.94 4.23,11.3 X1.P
  Bottom 0.406: v15.66,17.78 15.66,15.49 v14.64,14.48
N$4  (via drill 0.35)
  Top 0.152: U$2.9 39.18,9.25 39.76,8.66 v41.19,8.66
  Bottom 0.152: v41.19,8.66 42.28,7.58 C5.2
  other vias: 42.33,7.58
N$5
  Top 0.254: U1.P$10 33.18,18.92 33.06,19.05 33.06,20.19 33.31,20.45 35.85,20.45 D1.A
  Top 0.61: D1.A 38.18,19.68 R10.2
N$6  (via drill 0.35)
  Top 0.61: J3.2 58.82,15.73 v58.84,15.75
  Bottom 0.61: v58.84,15.75 63.28,11.3 S1.2
N$7  (via drill 0.3)
  Top 0.406: U4.3 v47.54,16.38
  Bottom 0.406: v47.54,16.38 47.6,16.32 C13.1
  other vias: 47.6,13.46
N$8
  Top 0.305: R13.1 36.74,8.09 LED1.C
N$9
  Top 0.305: U1.P$5 34.56,10.55 LED1.A
N$10
  Top 0.406: R7.2 51.35,19.38 U4.8
N$11
  Top 0.406: U3.3 58.78,10.7 R4.2
N$12  (via drill 0.3)
  Top 0.152: v31.53,12.32 31.03,12.83 28.14,12.83 27.51,13.46 23.38,13.46 21.24,11.32 16.32,11.32 16.29,11.3 13.63,11.3 13.08,11.85 U$36.BLUE
  Bottom 0.152: R12.2 35.15,4.06 33.93,2.91 33.45,2.91 31.92,4.38 31.92,11.94 v31.53,12.32
  other vias: 39.07,4.06
N$13  (via drill 0.3)
  Top 0.152: v31.33,11.43 30.24,12.52 28.02,12.52 27.38,13.16 23.5,13.16 20.12,9.78 18.28,9.78 15.92,9.78 14.9,8.76 13.19,8.76 U$36.GREEN
  Bottom 0.152: R14.2 41.79,3.48 38.83,3.48 38.55,3.76 35.28,3.76 34.06,2.61 33.33,2.61 31.61,4.13 31.61,11.15 v31.33,11.43
  other vias: 42.37,4.06
N$14  (via drill 0.3)
  Top 0.152: v31.03,10.57 30.65,10.95 30.65,11.56 29.99,12.22 27.89,12.22 27.26,12.85 23.63,12.85 19.1,8.32 16.09,8.32 16.03,8.38 12.07,8.38 U$36.RED
  Bottom 0.152: R15.2 44.78,3.18 38.7,3.18 38.42,3.45 35.4,3.45 34.19,2.3 32.92,2.3 31.28,3.94 31.28,10.32 v31.03,10.57
  other vias: 45.67,4.06
NRESET_3V  (via drill 0.35)
  Top 0.152: U$2.11 40.18,9.39 40.3,9.27 41.95,9.27 41.95,8.82 v42.1,8.66
  Bottom 0.152: v42.1,8.66 42.65,8.66 R11.1
  other vias: 43.73,7.58
PS0_3V  (via drill 0.35)
  Top 0.152: U$2.6 37.68,9.35 38.31,8.71 v38.85,8.71
  Bottom 0.152: v38.85,8.71 39.8,8.71 R1.1
  other vias: 40.93,7.58
PS1_3V  (via drill 0.35)
  Top 0.152: U$2.5 37.12,10.12 37.12,9.21 v37.07,9.16
  Bottom 0.152: v37.07,9.16 38.05,8.19 38.39,8.19 39,7.58 R2.1
  other vias: 39.54,7.58
SCK  (via drill 0.3)
  Top 0.152: v23.79,16 23.15,16 21.83,17.32 16.03,17.32 15.9,17.2 14.46,17.2 SPI.5
  Bottom 0.152: U$1.11 31.57,2.97 27.93,2.97 27.45,3.45 27.45,12.34 v23.79,16
SCL  (via drill 0.3, 0.35)
  Top 0.152: U$2.19 42.91,12.12 | 42.91,12.12 42.96,12.06 42.96,11.05 43.46,10.55 v43.85,10.55 44.27,10.55 44.38,10.44 44.85,10.44 44.95,10.34 IC1.2 | I2C1.4 I2C2.4 14.77,5.33 16.08,5.33 16.09,5.32 20.48,5.32 21.56,6.41 v21.56,7.37 22.1,7.9 v28.11,7.9 | v53.38,9.27 53.51,9.4 U2.6 | v28.33,13.46 31.44,13.46 v31.66,13.24 | 42.91,12.12 43.75,12.95 R8.1
  Bottom 0.152: U$1.27 21.56,19.66 v21.56,7.37 | v53.38,9.27 52.1,10.55 v43.85,10.55 34.35,10.55 v31.66,13.24 | v28.11,7.9 28.11,7.94 28.69,8.52 28.69,9 28.05,9.64 28.05,13.19 v28.33,13.46
SDA  (via drill 0.3, 0.35)
  Top 0.152: R9.1 46.54,7.58 v46.58,7.55 47.32,6.8 49.91,6.8 49.96,6.86 51.85,6.86 54.78,9.78 U2.5 54.78,13.72 54.05,14.44 46.48,14.44 v46.27,14.22 v44.48,14.22 | I2C1.3 I2C2.3 13.63,6.73 16.04,6.73 16.09,6.78 18.28,6.78 18.33,6.73 20.23,6.73 v20.61,7.11 20.96,7.46 20.96,7.62 22.06,8.72 25.72,8.72 25.76,8.76 v28.11,8.76 | U$2.20 42.18,13.74 v41.95,13.97 | IC1.4 44.47,9.73 44.38,9.73 44.22,9.9 v43.29,9.9 | v27.72,14.1 v31.68,14.1
  Bottom 0.152: U$1.28 20.96,7.46 v20.61,7.11 | v44.48,14.22 42.2,14.22 v41.95,13.97 41.95,14.73 41.57,15.11 40.81,15.11 40.63,14.93 40.63,14.66 40.28,14.32 36.36,14.32 36.14,14.1 v31.68,14.1 | v46.58,7.55 46.58,9.53 46.2,9.9 v43.29,9.9 | v28.11,8.76 28.11,8.89 27.75,9.25 27.75,14.07 v27.72,14.1
SDO/ADR  (via drill 0.3)
  Top 0.152: IC1.5 43.52,9.09 v43.47,9.04
  Bottom 0.152: v43.47,9.04 45.65,6.86 47.19,6.86 R6.1
  other vias: 47.92,7.58
VBAT  (via drill 0.35)
  Bottom 0.406: U$1.17 53.89,21.59 56.99,18.49 D2.A
  Bottom 0.61: S1.1 60.4,12.45 D2.A
  other vias: 56.99,12.45
VUSB  (via drill 0.35)
  Top 0.406: D2.C 60.69,10.91 R4.1 v60.68,10.7 U3.1
  Bottom 0.406: v60.68,10.7 56.97,10.7 | 56.97,10.7 C9.1 | U$1.19 44.96,20.45 54.24,20.45 56.17,18.51 56.17,11.43 56.91,10.7 56.97,10.7
  other vias: 56.93,10.73

### Text on the board
tNames: 33 | 15 | 32 | 14 | CS | SPI | 3v3 | ⏚ | MO | MI | SCK | 3v3 | H | 3v3 | CAN | L | ⏚ | 3v3 | ⏚ | SDA | SCL | I2C